# Altium schematic sheet jtag-buffer.SchDoc: Copper Suicide - JTAG Buffer
size Letter; CheckedBy: E. Chiu; CompanyName: Signal Laboratories, Inc.; DrawnBy: J. Brinton; Engineer: J. Brinton; Address1: 3479 Edison Way; Address2: Menlo Park CA 94025; Address3: +1 (877) 778-8435; Address4: siglabs.com; Revision: 1; SheetNumber: 35; SheetTotal: 43
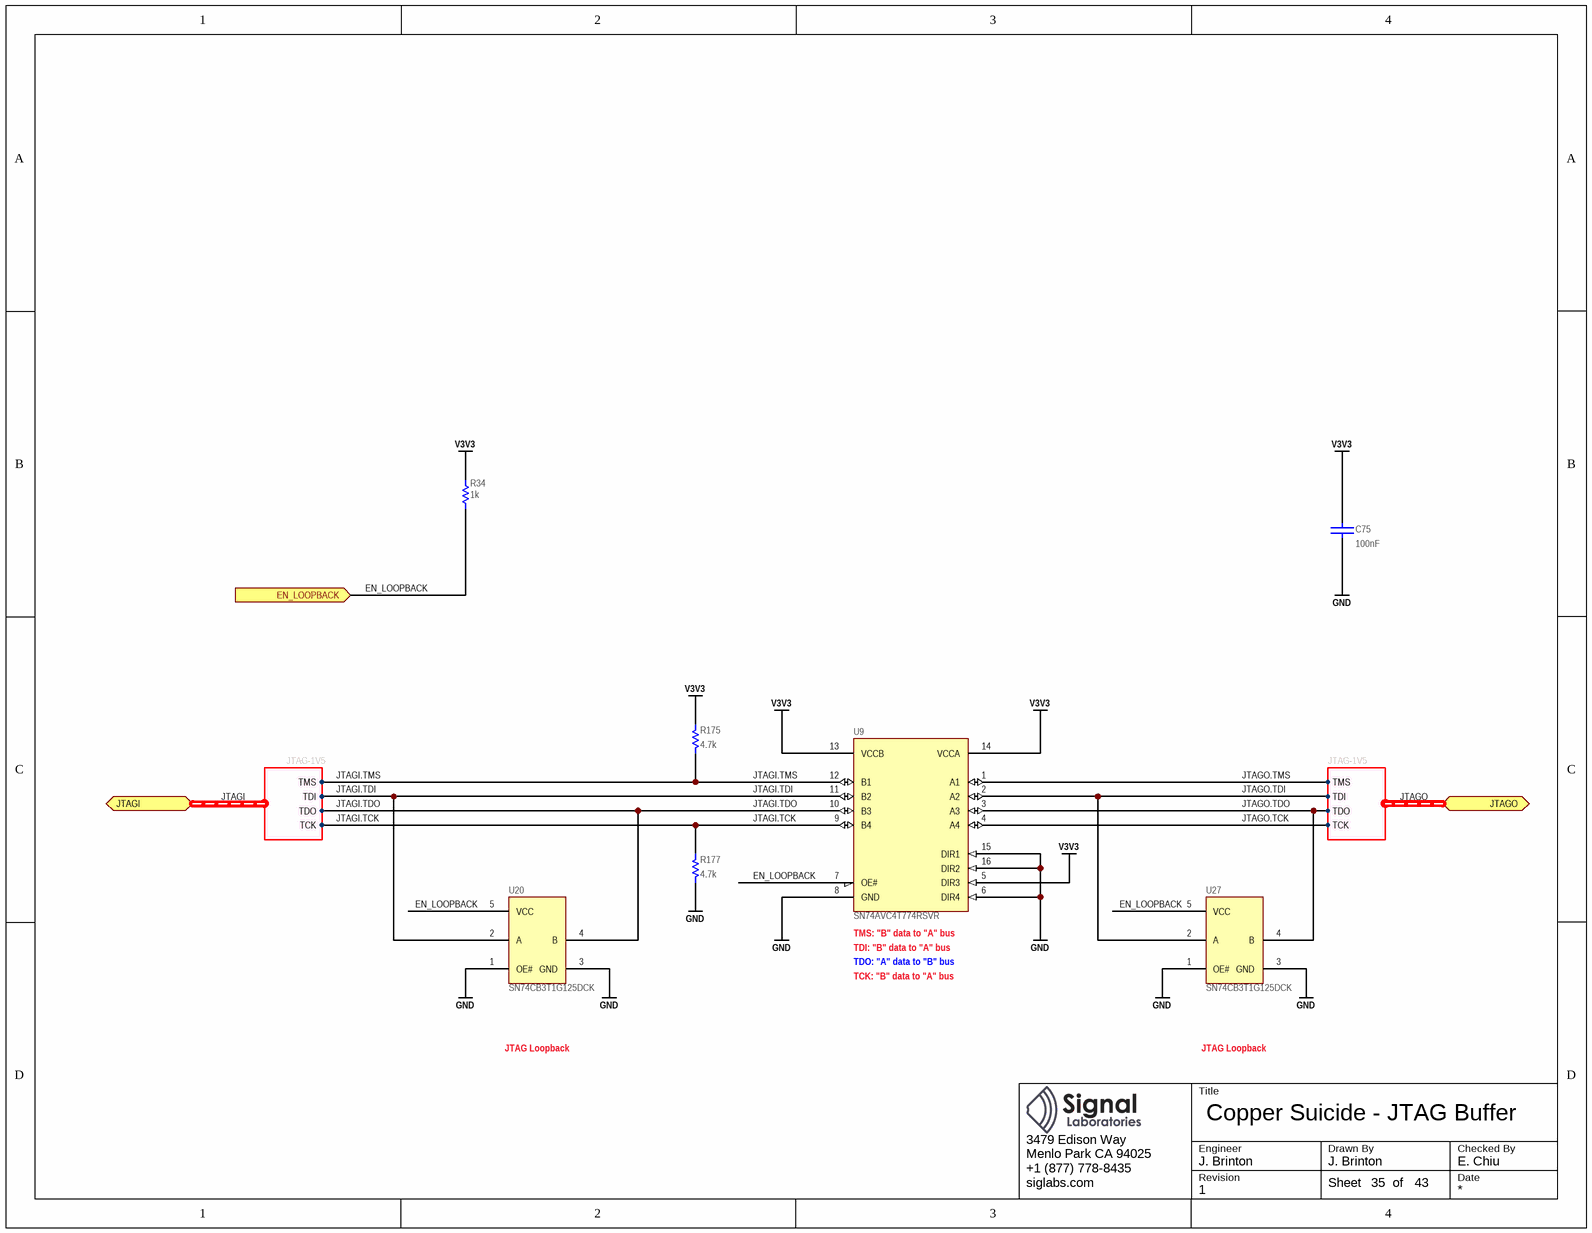
[diagram p0: jtag-buffer.SchDoc]

## Parts
C75  value 100nF  [CAPC100X50X55L25N]  (hidden comment: GCM155R71H104KE02)
R34  value 1k  [RESC1005X40N]  (hidden comment: ERJ-2RKF1001X)
R175  value 4.7k  [RESC1005X40N]  (hidden comment: ERJ-2RKF4701X)
R177  value 4.7k  [RESC1005X40N]  (hidden comment: ERJ-2RKF4701X)
U9  SN74AVC4T774RSVR  [RSV]
U20  SN74CB3T1G125DCK  [DCK]
U27  SN74CB3T1G125DCK  [DCK]

## Ports
EN_LOOPBACK (in), JTAGI (harness JTAG-1V5), JTAGO (harness JTAG-1V5)

## Harnesses
JTAG-1V5: TMS, TCK, TDI, TDO

## Nets
GND: C75.1 R177.1 U9.6(DIR4) U9.8(GND) U9.15(DIR1) U9.16(DIR2) U20.1(OE#) U20.3(GND) U27.1(OE#) U27.3(GND)
V3V3: C75.2 R34.2 R175.2 U9.5(DIR3) U9.13(VCCB) U9.14(VCCA)
EN_LOOPBACK: R34.1 U9.7(OE#) U20.5(VCC) U27.5(VCC) ; port EN_LOOPBACK
JTAGI.TCK: R177.2 U9.9(B4) ; port JTAGI.TCK
JTAGI.TDI: U9.11(B2) U20.2(A) ; port JTAGI.TDI
JTAGI.TDO: U9.10(B3) U20.4(B) ; port JTAGI.TDO
JTAGI.TMS: R175.1 U9.12(B1) ; port JTAGI.TMS
JTAGO.TCK: U9.4(A4) ; port JTAGO.TCK
JTAGO.TDI: U9.2(A2) U27.2(A) ; port JTAGO.TDI
JTAGO.TDO: U9.3(A3) U27.4(B) ; port JTAGO.TDO
JTAGO.TMS: U9.1(A1) ; port JTAGO.TMS

## Buses and harness runs
harness JTAGI = port JTAGI
harness JTAGO = port JTAGO

## Notes on the sheet
- (near U9) TMS: "B" data to "A" bus
- (near U9) TDI: "B" data to "A" bus
- TDO: "A" data to "B" bus
- TCK: "B" data to "A" bus
- JTAG Loopback
- Title
- Engineer
- Revision
- Drawn By
- Checked By
- Date
- Sheet
- of

## Library data of the parts
C75 = CAP: Ceramic Capacitor 100nF ±10% 50V X7R 0402; Manufacturer: Murata; Tr: -55:125; Manufacturer P/N: GCM155R71H104KE02; Tolerance: ±10%; Voltage: 50V; Footprint: *; Package: 0402
R34 = RES: Thick Film Resistor 1k ±1% 0.1W 50V 0402; Manufacturer: Panasonic; Tcr: ±100; Tr: -55:155; Voltage: 50; Power: 0.1; Manufacturer P/N: ERJ-2RKF1001X; Tolerance: ±1%; Alternatives: *; Footprint: *; Package: 0402
R175 R177 = RES: Thick Film Resistor 4.7k ±1% 0.1W 75V 0402; Manufacturer: Panasonic; Tcr: ±100; Tr: -55:155; Voltage: 75; Power: 0.1; Tolerance: ±1%; Manufacturer P/N: ERJ-2RKF4701X; Alternatives: *; Footprint: *; Package: 0402
U9 = SN74AVC4T774RSVR: 4-Bit Dual-Supply Bus Transceiver; Manufacturer: Texas Instruments; Manufacturer P/N: SN74AVC4T774RSVR
U20 U27 = SN74CB3T1G125DCK: Single FET Bus Switch; Manufacturer: Texas Instruments; Manufacturer P/N: SN74CB3T1G125DCK